# Altium schematic sheet voltage_measurment.SchDoc
size Letter
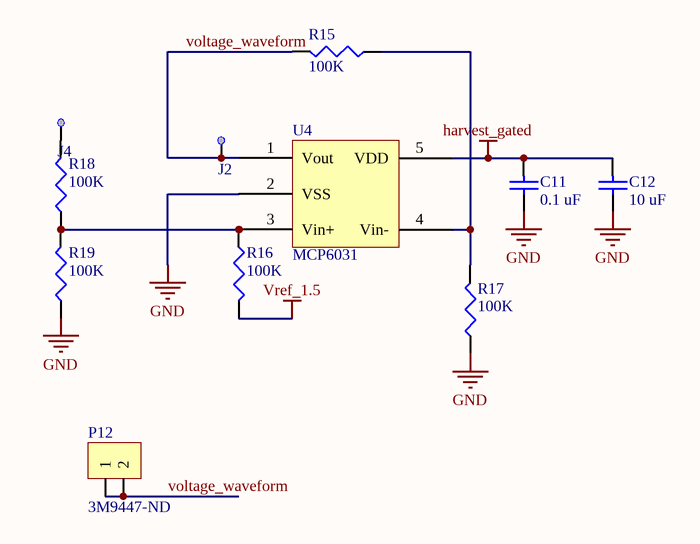
[diagram p0: voltage_measurment.SchDoc]

## Parts
C11  value 0.1 uF  [0603]  (hidden comment: Ceramic capacitor)
C12  value 10 uF  [0603]  (hidden comment: Ceramic capacitor)
J2  5004  [TestPoint]  (value not drawn)
J4  5004  [TestPoint]  (value not drawn)
P12  Supplier Part Number 1: 3M9447-ND  [1x2 header]  (hidden comment: 1 x 2 header)
R15  value 100K  [0603]  (hidden comment: Chip resistor)
R16  value 100K  [0603]  (hidden comment: Chip resistor)
R17  value 100K  [0603]  (hidden comment: Chip resistor)
R18  value 100K  [0603]  (hidden comment: Chip resistor)
R19  value 100K  [0603]  (hidden comment: Chip resistor)
U4  MCP6031  [SOT23-5]

## Nets
GND: C11.2 C12.2 R17.2 R19.2 U4.2(VSS)
harvest_gated: C11.1 C12.1 U4.5(VDD)
Vref_1.5: R16.1
voltage_waveform: J2.1(TB) P12.1 P12.2 R15.1 U4.1(Vout)
NetJ4_1: J4.1(TB) R18.1
NetR15_2: R15.2 R17.1 U4.4(Vin-)
NetR16_2: R16.2 R18.2 R19.1 U4.3(Vin+)

## Notes on the sheet
- Title
- Date:
- Author:
- Revision:
- Sheet
- of
- University of Michigan
- File:

## Library data of the parts
C11 = C_0.1u_25V_0603_ceramic: Ceramic capacitor, 0.1 uF, 0603 package; Manufacture: TDK; voltage rated: 25V; tolerance: 10%; package: 0603; Supplier 1: Digi-Key; Supplier Part Number 1: 445-1316-1-ND
C12 = C_10u_6.3V_0603_ceramic: Ceramic capacitor, 10 uF, 0603 package; Manufacture: TDK; voltage rated: 6.3V; tolerance: 20%; package: 0603; Supplier 1: Digi-Key; Supplier Part Number 1: 445-4112-1-ND
J2 J4 = TestPoint: TEST POINT PC MINI .040"D YELLOW; Supplier 1: Digi-Key; Supplier Part Number 1: 5004K-ND; datasheet: http://mail.keyelco.com/ENG._DEPT/PDF%20CAT%20NO%20Drawings/5004.pdf
P12 = 1 x 2 header: 100 mils standard header; Supplier 1: Digi-Key
R15-R19 = R_100K_0603: Chip resistor, 100K, 0603 package; tolerance: 1%; power: 1/10 W; package: 0603; Supplier 1: Digi-Key; Supplier Part Number 1: 541-100KHCT-ND
U4 = MCP6031: 0.9 µA, High Precision Op Amps; Supplier 1: Digi-Key; Supplier Part Number 1: MCP6031T-E/OTCT-ND